# EAGLE design board-Type-C-31-M-17 (EAGLE 9.6.0)
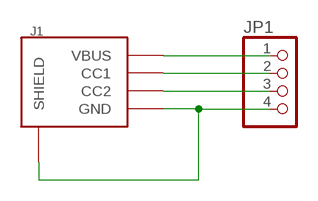
[diagram p0: schematic, sheet 1]

## Parts
J1  USB-TYPE-C-31-M-17  [USB-TYPE-C-31-M-17]
JP1  PINHD-1X4/OCT  [1X04/OCT]

## Nets
N$1 [power]: J1.GND J1.GND_2(GND) J1.SHLD-B1(SHIELD) J1.SHLD-B2(SHIELD) J1.SHLD-B3(SHIELD) J1.SHLD-B4(SHIELD) J1.SHLD-T1(SHIELD) J1.SHLD-T2(SHIELD) J1.SHLD-T3(SHIELD) J1.SHLD-T4(SHIELD) JP1.4
N$2 [power]: J1.VBUS J1.VBUS_2(VBUS) JP1.1
N$3: J1.CC1 JP1.2
N$4: J1.CC2 JP1.3

## Library data of the parts
J1 = angrypig7-Connectors:USB-TYPE-C-31-M-17: Type-C-31-M16/17 By Korean Hroparts Elec link <https://lcsc.com/product-detail/Others_Korean-Hroparts-Elec-TYPE-C-31-M-17_C283540.html>
JP1 = pinhead_v2:PINHD-1X4: PIN HEADER

## Net classes
0 default: width 0.254 mm
1 power: width 0.457 mm

## Board
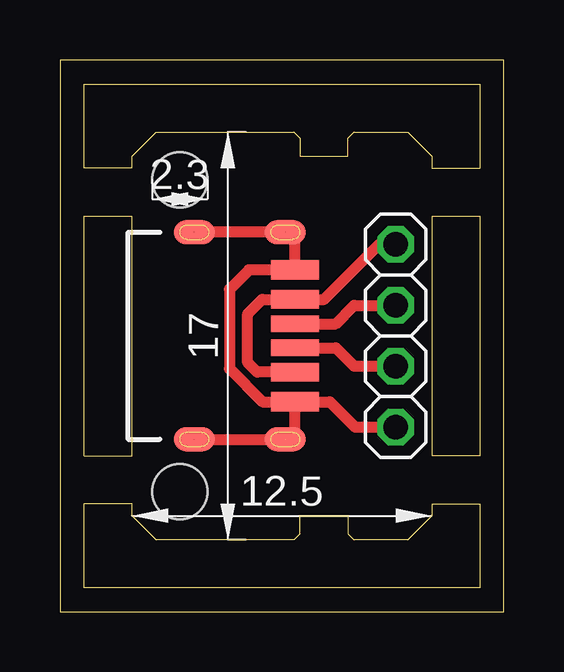
[diagram p1: board, top side]
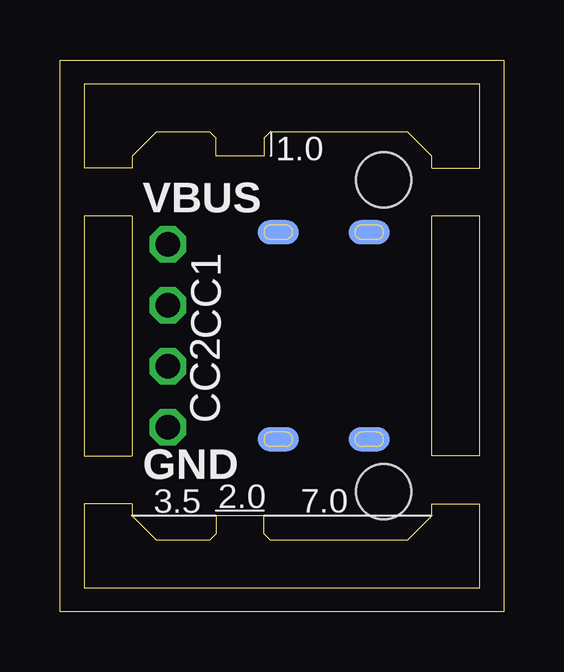
[diagram p2: board, bottom side, seen from below]

Size 18.5 x 23 mm. Coordinates in mm from the lower left corner, seen from the top.
Outline: 3,4 3,4.5 1,4.5 1,1 17.5,1 17.5,4.5 15.5,4.5 15.5,4 14.5,3 12.25,3 12,3.25 12,4 10,4 10,3.25 9.75,3 4,3 3,4
Outline: 3,6.5 3,16.5 1,16.5 1,6.5 3,6.5
Outline: 3,18.5 3,19 4,20 9.75,20 10,19.75 10,19 12,19 12,19.75 12.25,20 14.5,20 15.5,19 15.5,18.5 17.5,18.5 17.5,22 1,22 1,18.5 3,18.5
Outline: 15.5,16.5 15.5,6.5 17.5,6.5 17.5,16.5 15.5,16.5
Outline: 0,0 18.5,0 18.5,23 0,23 0,0
Copper layers (1*16): Top 0.035mm / dielectric 1.5mm / Bottom 0.035mm
Design rules "default *": minimum track width 6mil, minimum drill 0.35mm, track to track 6mil, track to pad 6mil, pad to pad 6mil, via to via 6mil, smd to smd 6mil, copper to edge 4mil, drill to drill 6mil, minimum pad ring 10mil, minimum via ring 8mil, stop-mask expansion 4mil, vias tented up to drill 0mil, thermal gap 10mil
Holes 2.3 mm at 5,18 5,5

### Footprints (pad centres in the part's own frame; a part is rotated, then mirrored left to right if it is on the bottom)
USB-TYPE-C-31-M-17 = smd 0.7 x 2: CC1 -0.5,0.4; CC2 0.5,0.4 | smd 0.8 x 2: GND -2.75,0.4; GND_2 2.75,0.4 | smd 1 x 1.7 bottom: SHLD-B1 -4.32,0; SHLD-B2 4.32,0; SHLD-B3 -4.32,-3.8; SHLD-B4 4.32,-3.8 | smd 1 x 1.7: SHLD-T1 -4.32,0; SHLD-T2 4.32,0; SHLD-T3 -4.32,-3.8; SHLD-T4 4.32,-3.8 | smd 0.76 x 2: VBUS -1.52,0.4; VBUS_2 1.52,0.4
1X04/OCT = drill 1.016 octagon: 1 -3.81,0; 2 -1.27,0; 3 1.27,0; 4 3.81,0

### Placement (x,y rotation side)
J1  9.4,11.5 270 top
JP1  14,11.5 270 top

### Tracks (layer width: path | path; a pad name or v marks a point on that pad's centre or on a via)
N$1  (4 unrouted)
  Top 0.457: J1.SHLD-T3 J1.SHLD-T1 9.8,15.42 J1.GND 7.88,14.25 7.06,13.43 7.06,10.13 8.44,8.75 J1.GND_2 | J1.SHLD-T4 J1.SHLD-B2 9.8,7.58 J1.GND_2 | J1.GND_2 11.25,8.75 12.31,7.69 JP1.4
N$2
  Top 0.457: J1.VBUS_2 8.23,9.98 7.83,10.38 7.83,12.41 8.43,13.02 J1.VBUS 11.02,13.02 13.31,15.31 JP1.1
N$3
  Top 0.457: J1.CC1 11.5,12 12.27,12.77 JP1.2
N$4
  Top 0.457: J1.CC2 11.5,11 12.27,10.23 JP1.3

### Text on the board
bPlace: 1.0 | VBUS | CC1 | CC2 | GND | 7.0 | 2.0 | 3.5